# Altium project Power_board_teensy V2.0.PrjPcb
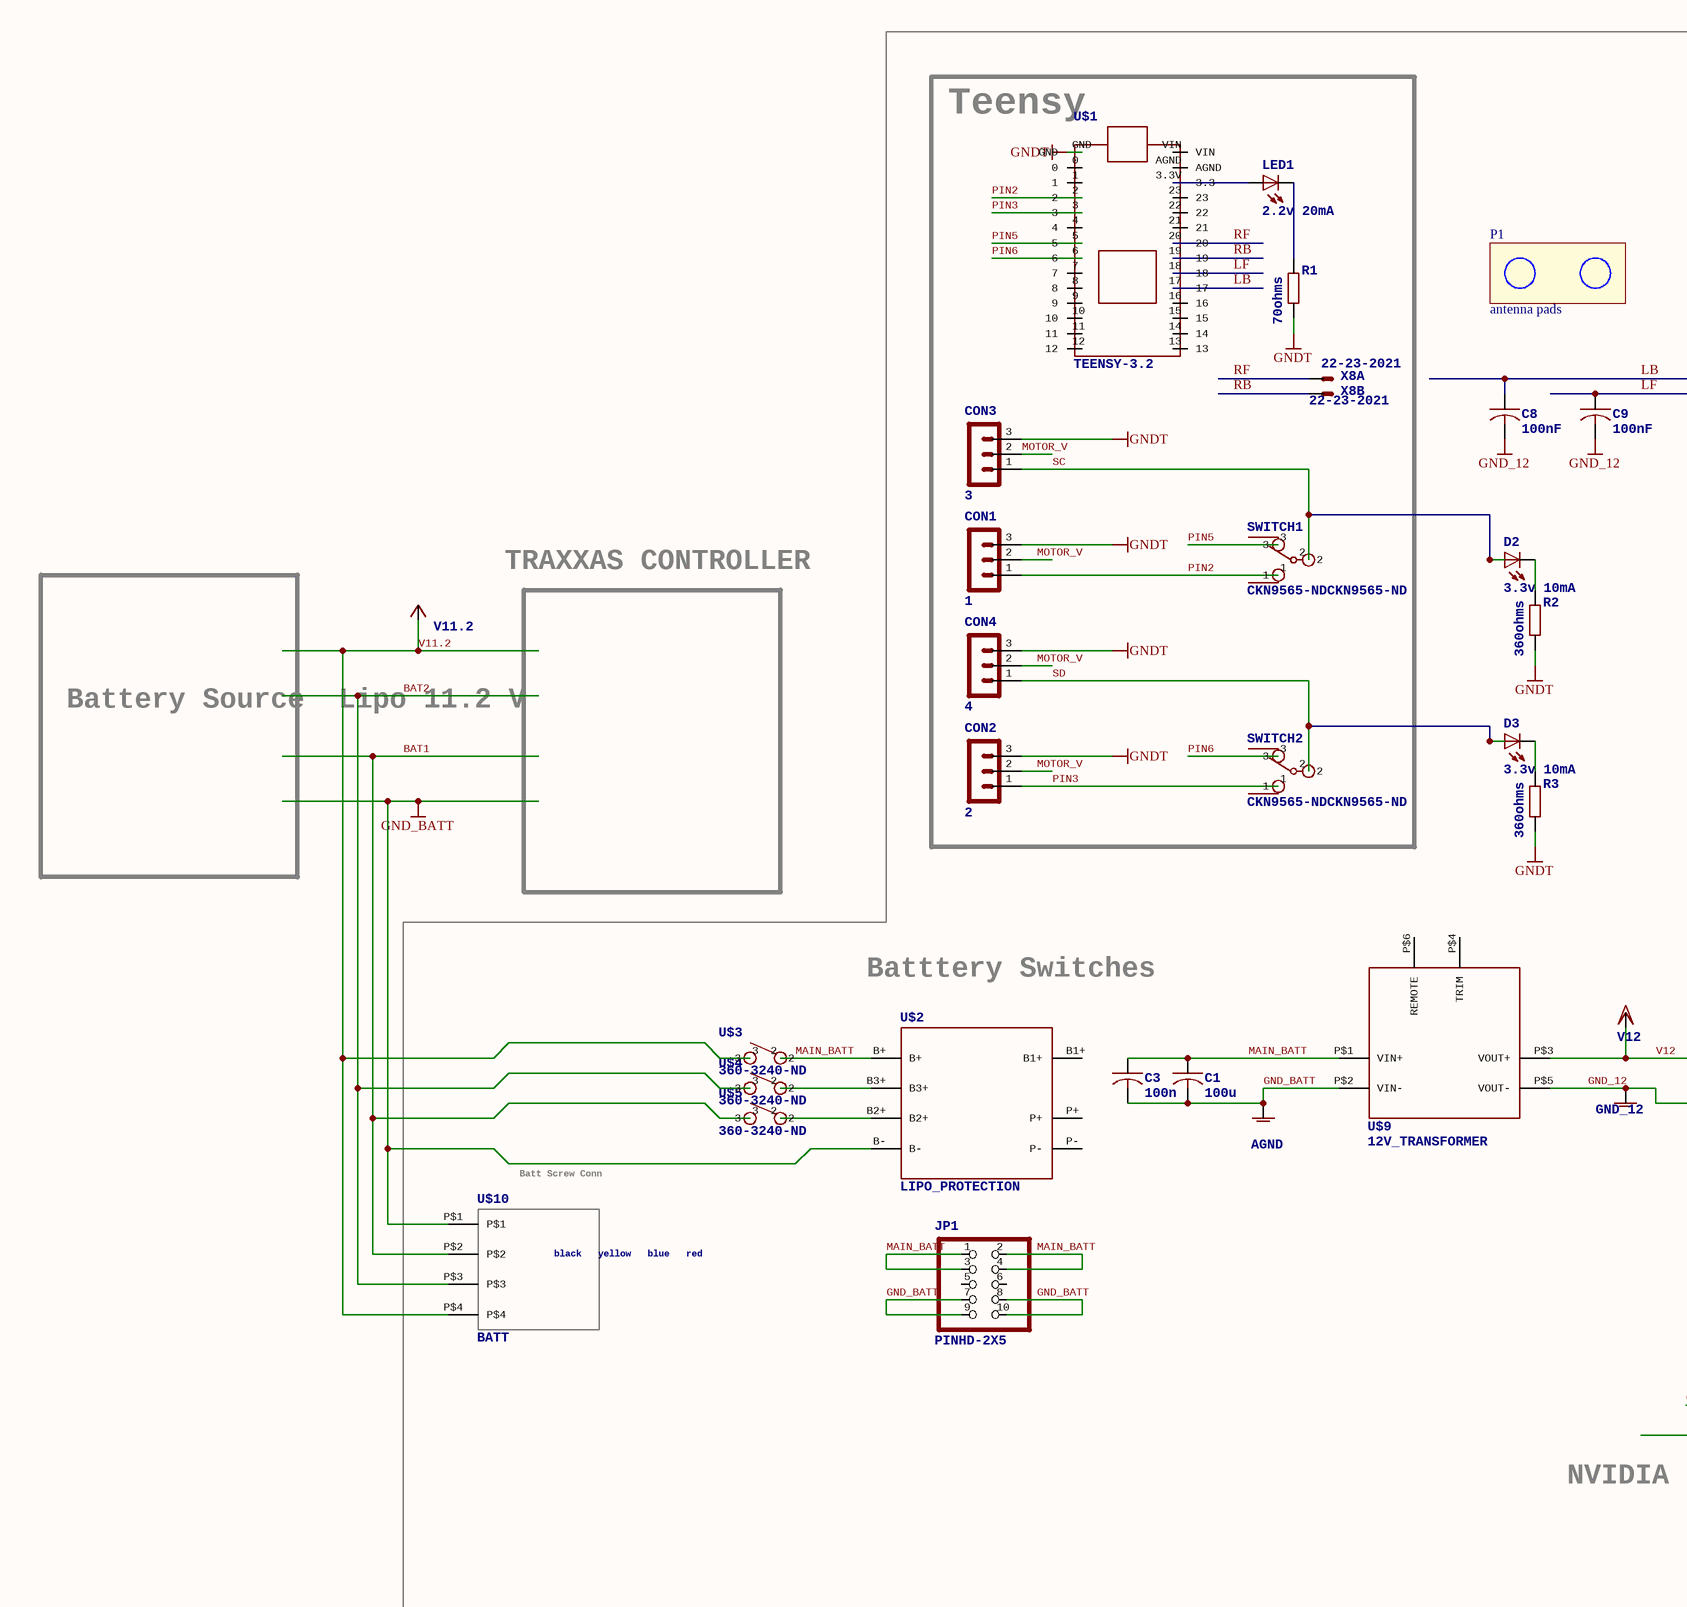
[diagram p0: Power_board_teensy V2.0.SchDoc, left]
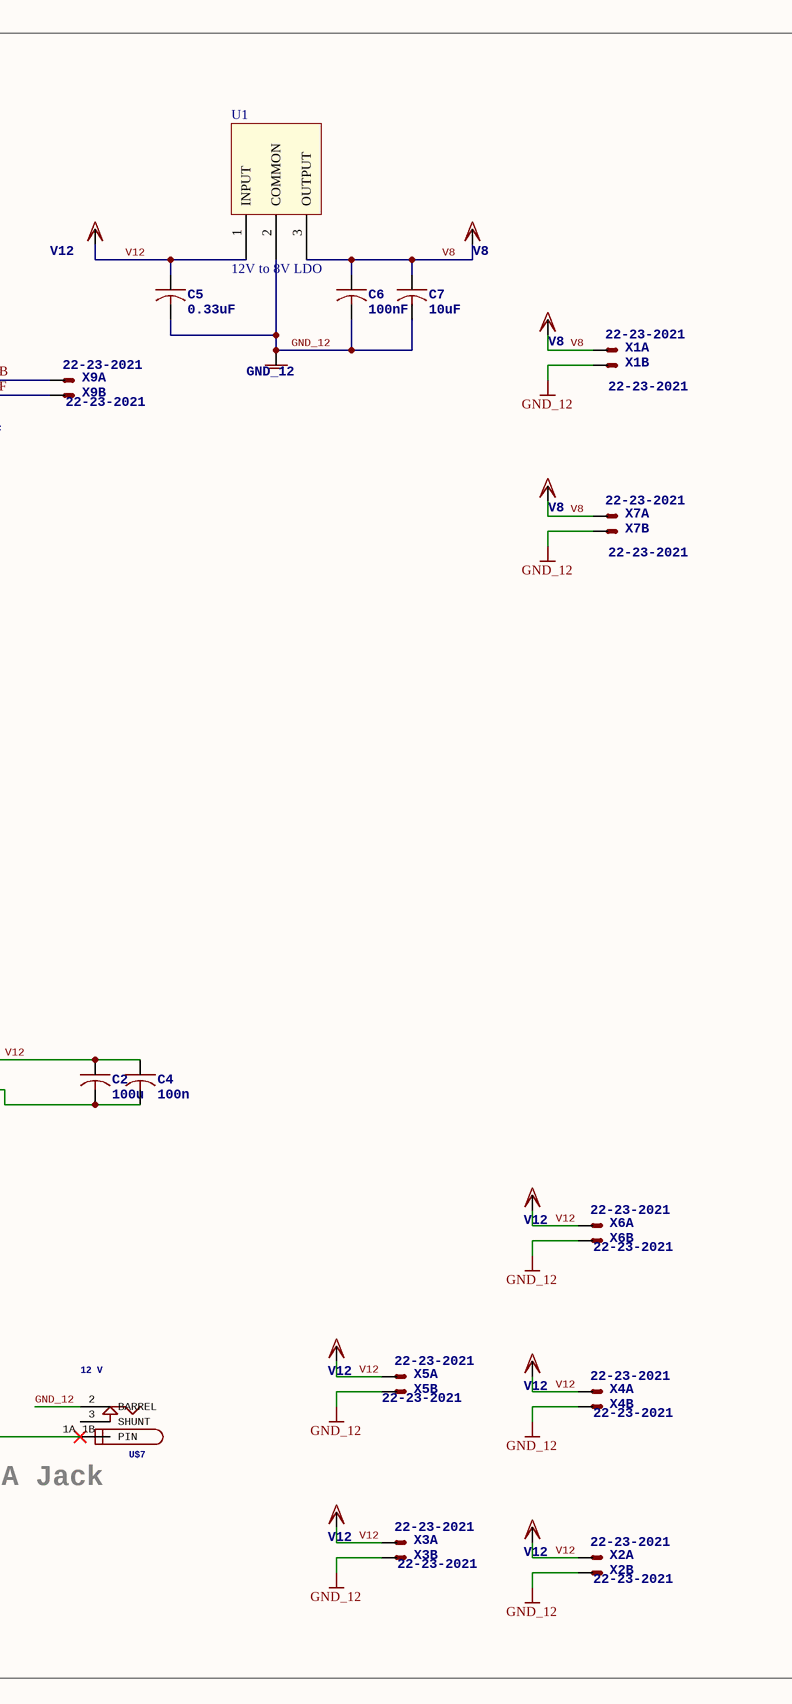
[diagram p1: Power_board_teensy V2.0.SchDoc, right]
1 sheet, 55 parts. Net scope: global (net labels, ports and power ports of the same name join across sheets).
Board file: Power_board_teensy V2.0.PcbDoc

## Sheet Power_board_teensy V2.0.SchDoc
size 436 x 302 mm

### Parts
AGND1  GND_12
AGND2  AGND
AGND3  GND_12
C1  100u  [C050-035X075]
C2  100u  [C050-035X075]
C3  100n  [C050-035X075]
C4  100n  [C050-035X075]
C5  0.33uF  [C050-035X075]
C6  100nF  [C050-035X075]
C7  10uF  [C050-035X075]
C8  100nF  [C050-035X075]
C9  100nF  [C050-035X075]
CON1  1  [MA03-1]
CON2  2  [MA03-1]
CON3  3  [MA03-1]
CON4  4  [MA03-1]
D2  3.3v 10mA  [LED5MM]
D3  3.3v 10mA  [LED5MM]
JP1  PINHD-2X5  [2X05]
LED1  2.2v 20mA  [LED5MM]
P1  antenna pads  [Antenna pads]
R1  70ohms  [0207/10]
R2  360ohms  [0207/10]
R3  360ohms  [0207/10]
SWITCH1  CKN9565-NDCKN9565-ND  [CKN9565-ND]
SWITCH2  CKN9565-NDCKN9565-ND  [CKN9565-ND]
U1  12V to 8V LDO  [BA7808CP-E2]
U$1  TEENSY-3.2  [TEENSY-3.2]
U$2  LIPO_PROTECTION  [LIPO_PROTECTION]
U$3  360-3240-ND  [360-3240-ND]
U$4  360-3240-ND  [360-3240-ND]
U$5  360-3240-ND  [360-3240-ND]
U$7  12 V  [CP-054-ND]
U$9  12V_TRANSFORMER  [12V_TRANSFORMER]
U$10  BATT  black

yellow

blue

red: black / yellow / blue / red  [BATTERY_CONNECTOR]
V1  V11.2
VDD1  V12
VDD2  V8
VDD3  V8
VDD4  V8
VDD5  V12
VDD6  V12
VDD7  V12
VDD8  V12
VDD9  V12
VDD10  V12
X1  22-23-2021  [22-23-2021]  (parts A,B of 2)
X2  22-23-2021  [22-23-2021]  (parts A,B of 2)
X3  22-23-2021  [22-23-2021]  (parts A,B of 2)
X4  22-23-2021  [22-23-2021]  (parts A,B of 2)
X5  22-23-2021  [22-23-2021]  (parts A,B of 2)
X6  22-23-2021  [22-23-2021]  (parts A,B of 2)
X7  22-23-2021  [22-23-2021]  (parts A,B of 2)
X8  22-23-2021  [22-23-2021]  (parts A,B of 2)
X9  22-23-2021  [22-23-2021]  (parts A,B of 2)

### Blocks framed on the sheet
Teensy: CON1-CON4 LED1 R1 SWITCH1 SWITCH2 U$1 X8

### Nets
GND_12: AGND1.?1(AGND) AGND3.?1(AGND) C2.2 C4.2 C5.2 C6.2 C7.2 C8.2 C9.2 U1.2(COMMON) U$7.2(BARREL) U$9.P$5(VOUT-) X1.2(S) X2.2(S) X3.2(S) X4.2(S) X5.2(S) X6.2(S) X7.2(S)
GND_BATT: AGND2.?1(AGND) C1.2 C3.2 JP1.7 JP1.8 JP1.9 JP1.10 U$2.B- U$9.P$2(VIN-) U$10.P$1
GNDT: CON1.3 CON2.3 CON3.3 CON4.3 R1.2 R2.2 R3.2 U$1.GND
BAT1: U$5.3 U$10.P$2
BAT2: U$4.3 U$10.P$3
LB: C8.1 U$1.17 X9.1(S)
LF: C9.1 U$1.18 X9.2(S)
MAIN_BATT: C1.1 C3.1 JP1.1 JP1.2 JP1.3 JP1.4 U$2.B+ U$3.2 U$9.P$1(VIN+)
MOTOR_V: CON1.2 CON2.2 CON3.2 CON4.2
PIN2: CON1.1 SWITCH1.1 U$1.2
PIN3: CON2.1 SWITCH2.1 U$1.3
PIN5: SWITCH1.3 U$1.5
PIN6: SWITCH2.3 U$1.6
RB: U$1.19 X8.2(S)
RF: U$1.20 X8.1(S)
SC: CON3.1 D2.A SWITCH1.2
SD: CON4.1 D3.A SWITCH2.2
V8: C6.1 C7.1 U1.3(OUTPUT) VDD2.?1(VDD) VDD3.?1(VDD) VDD4.?1(VDD) X1.1(S) X7.1(S)
V11.2: U$3.3 U$10.P$4 V1.?1(VCC)
V12: C2.1 C4.1 C5.1 U1.1(INPUT) U$9.P$3(VOUT+) VDD1.?1(VDD) VDD5.?1(VDD) VDD6.?1(VDD) VDD7.?1(VDD) VDD8.?1(VDD) VDD9.?1(VDD) VDD10.?1(VDD) X2.1(S) X3.1(S) X4.1(S) X5.1(S) X6.1(S)
NetD2_K: D2.K(C) R2.1
NetD3_K: D3.K(C) R3.1
NetLED1_A: LED1.A U$1.3.3V(3.3)
NetLED1_K: LED1.K(C) R1.1
NetU$2_B2+: U$2.B2+ U$5.2
NetU$2_B3+: U$2.B3+ U$4.2

Not connected (* = marked no-connect by the designer): JP1 5 6; U$1 0 1 4 7 8 9 10 11 12 13 14 15 16 21 22 23 AGND VIN; U$2 B1+ P+ P-; U$7 1A 1B(PIN)* 3(SHUNT); U$9 P$4(TRIM) P$6(REMOTE)

### Notes on the sheet
- TRAXXAS CONTROLLER
- Battery Source
  Lipo 11.2 V
- Batttery Switches
- (near U$10) Batt Screw Conn
- (near U$7) NVIDIA Jack

### Library data of the parts
AGND1-AGND3 = AGND: SUPPLY SYMBOL
C1-C9 = C-US050-035X075: CAPACITOR, American symbol
CON1-CON4 = MA03-1: PIN HEADER; OC_FARNELL: unknown; OC_NEWARK: unknown
D2 D3 LED1 = LED5MM: LED   OSRAM: - CHIPLED LG R971, LG N971, LY N971, LG Q971, LY Q971, LO R971, LY R971 LH N974, LH R974 LS Q976, LO Q976, LY Q976 LO Q996 - Hyper CHIPLED LW Q18S LB Q993, LB Q99A, LB R99A - SideLED LS A670, LO A670, LY A670, LG A670, LP A670 LB A673, LV A673, LT A673, LW A673 LH A674 LY A675 LS A676, LA A676, LO A676, LY A676, LW A676 LS A679, LY A679, LG A679 -  Hyper Micro SIDELED® LS Y876, LA Y876, LO Y876, LY Y876 LT Y87S - SmartLED LW L88C, LW L88S LB L89C, LB L89S, LG L890 LS L89K, LO L89K, LY L89K LS L896, LA L896, LO L896, LY L896 - TOPLED LS T670, LO T670, LY T670, LG T670, LP T670 LSG T670, LSP T670, LSY T670, LOP T670, LYG T670 LG T671, LOG T671, LSG T671 LB T673, LV T673, LT T673, LW T673 LH T674 LS T676, LA T676, LO T676, LY T676, LB T676, LH T676, LSB T676, LW T676 LB T67C, LV T67C, LT T67C, LS T67K, LO T67K, LY T67K, LW E67C LS E67B, LA E67B, LO E67B, LY E67B, LB E67C, LV E67C, LT E67C LW T67C LS T679, LY T679, LG T679 LS T770, LO T770, LY T770, LG T770, LP T770 LB T773, LV T773, LT T773, LW T773 LH T774 LS E675, LA E675, LY E675, LS T675 LS T776, LA T776, LO T776, LY T776, LB T776 LHGB T686 LT T68C, LB T68C - Hyper Mini TOPLED® LB M676 - Mini TOPLED Santana® LG M470 LS M47K, LO M47K, LY M47K    Source: http://www.osram.convergy.de   LUXEON: - LUMILED® LXK2-PW12-R00, LXK2-PW12-S00, LXK2-PW14-U00, LXK2-PW14-V00 LXK2-PM12-R00, LXK2-PM12-S00, LXK2-PM14-U00 LXK2-PE12-Q00, LXK2-PE12-R00, LXK2-PE12-S00, LXK2-PE14-T00, LXK2-PE14-U00 LXK2-PB12-K00, LXK2-PB12-L00, LXK2-PB12-M00, LXK2-PB14-N00, LXK2-PB14-P00, LXK2-PB14-Q00 LXK2-PR12-L00, LXK2-PR12-M00, LXK2-PR14-Q00, LXK2-PR14-R00 LXK2-PD12-Q00, LXK2-PD12-R00, LXK2-PD12-S00 LXK2-PH12-R00, LXK2-PH12-S00 LXK2-PL12-P00, LXK2-PL12-Q00, LXK2-PL12-R00    Source: www.luxeon.com   KINGBRIGHT:   KA-3528ASYC Source: www.kingbright.com
JP1 = PINHD-2X5: PIN HEADER
R1-R3 = R0207/10: RESISTOR, European symbol
U1 = BA78M08FP-E2
U$1 = TEENSY-3.2TEENSY-3.2: 0.1" pin spacing
U$3-U$5 = 360-3240-ND: SPST two lead switch Pin 2 is common Swtich Closed on Down Position DigiKey: http://www.digikey.com/product-detail/en/nkk-switches/M2011S2A1W01/360-3240-ND/1049342 Data Sheet: http://2t70un3m1d9z1kztamkdrd38.wpengine.netdna-cdn.com/wp-content/uploads/2016/02/MtogglesBushing.pdf
U$7 = CP-054-ND: DigiKey: http://www.digikey.com/product-detail/en/cui-inc/PJ-054/CP-054-ND/1644595 Data Sheet: http://www.cui.com/product/resource/pj-054.pdf
U$9 = 12V_TRANSFORMER: CUI Inc │ SERIES: PDQ30-D │ DESCRIPTION: DC-DC CONVERTER http://www.mouser.com/pdfdocs/pdq30-d.pdf
U$10 = BATTERY_CONNECTOR
V1 = VCC: SUPPLY SYMBOL
VDD1-VDD10 = VDD: SUPPLY SYMBOL
X1-X9 = 22-23-2021: .100" (2.54mm) Center Header - 2 Pin; MF: MOLEX; MPN: 22-23-2021; OC_FARNELL: 1462926; OC_NEWARK: 25C3832